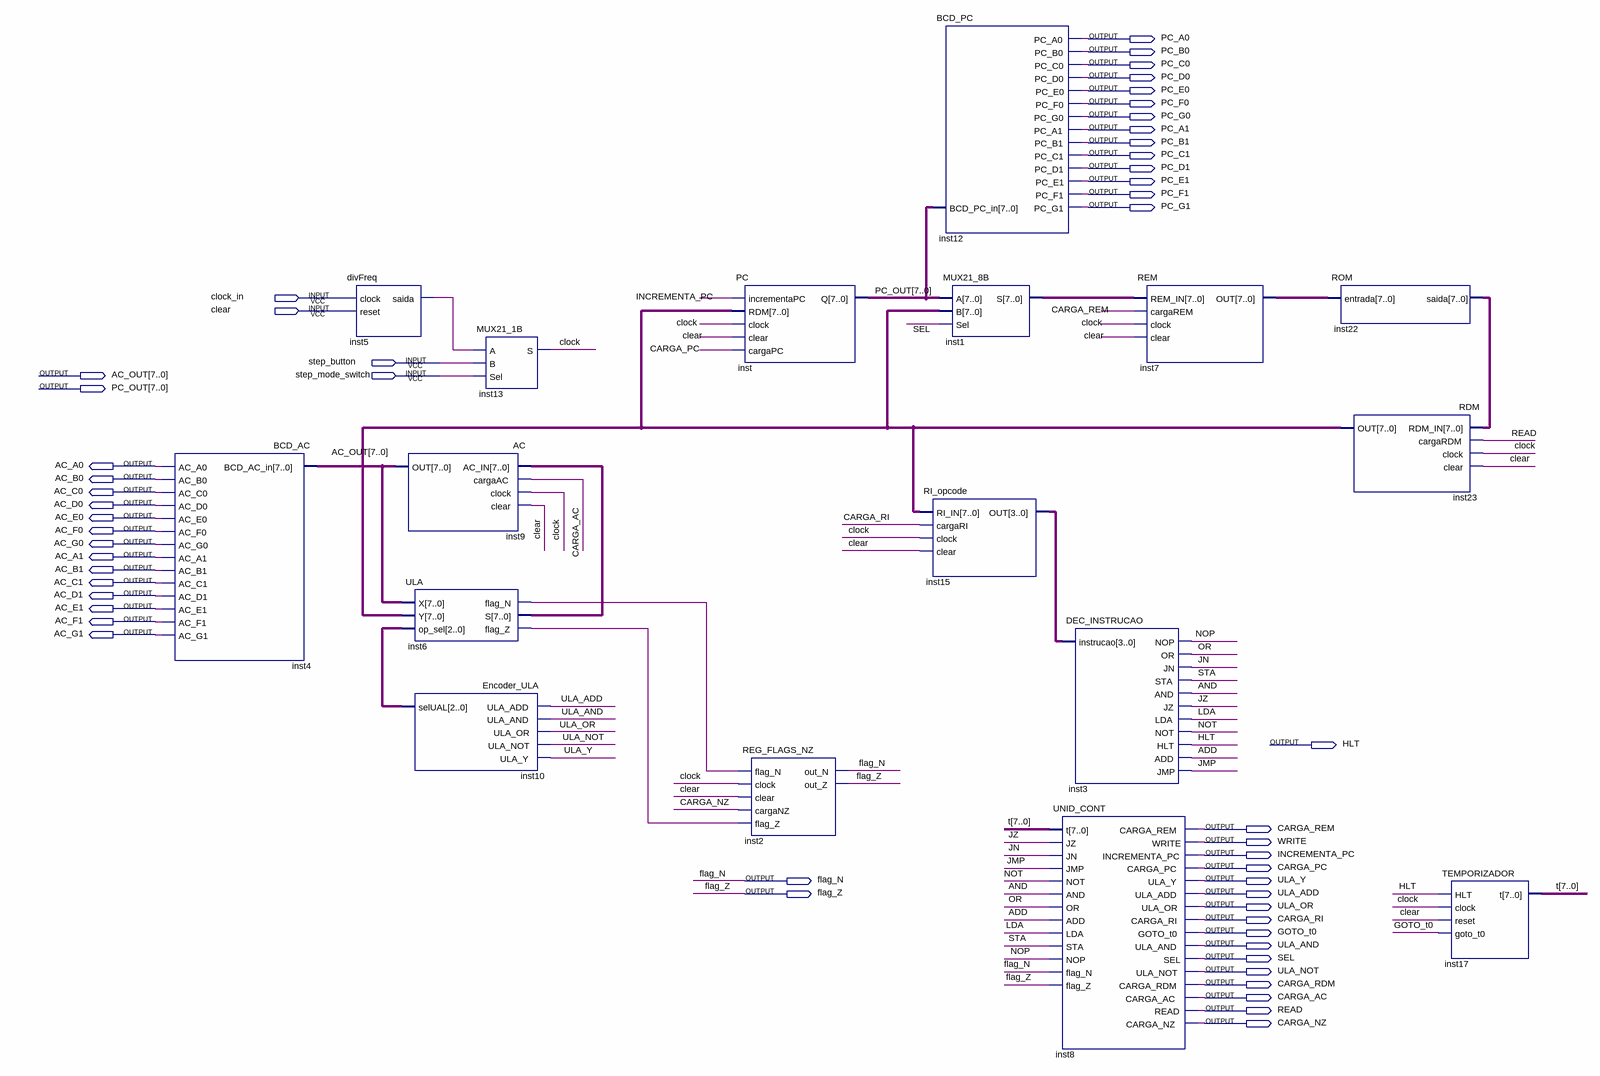
[diagram p0: schematic sheet]
// Quartus schematic Neander.bdf as structural Verilog: 17 symbols, 53 pins
module Neander (
  input  clock_in,
  input  clear,
  input  step_button,
  input  step_mode_switch,
  output PC_A0,
  output PC_B0,
  output PC_C0,
  output PC_D0,
  output PC_E0,
  output PC_F0,
  output PC_G0,
  output PC_A1,
  output PC_B1,
  output PC_C1,
  output PC_D1,
  output PC_E1,
  output PC_F1,
  output PC_G1,
  output [7:0] AC_OUT,
  output [7:0] PC_OUT,
  output AC_A0,
  output AC_B0,
  output AC_C0,
  output AC_D0,
  output AC_E0,
  output AC_F0,
  output AC_G0,
  output AC_A1,
  output AC_B1,
  output AC_C1,
  output AC_D1,
  output AC_E1,
  output AC_F1,
  output AC_G1,
  output HLT,
  output CARGA_REM,
  output WRITE,
  output INCREMENTA_PC,
  output CARGA_PC,
  output flag_N,
  output ULA_Y,
  output flag_Z,
  output ULA_ADD,
  output ULA_OR,
  output CARGA_RI,
  output GOTO_t0,
  output ULA_AND,
  output SEL,
  output ULA_NOT,
  output CARGA_RDM,
  output CARGA_AC,
  output READ,
  output CARGA_NZ
);

  wire ADD, AND, clock, inst5_saida, inst6_flag_n, inst6_flag_z, JMP, JN, JZ, LDA, NOP, NOT, OR, STA;
  wire [2:0] inst10_selual;
  wire [3:0] inst15_out;
  wire [7:0] inst1_s, inst6_s, inst7_out, inst22_saida, inst23_out, t;

  BCD_AC inst4 (
    .BCD_AC_in(AC_OUT), .AC_A0(AC_A0), .AC_B0(AC_B0), .AC_C0(AC_C0), .AC_D0(AC_D0), .AC_E0(AC_E0),
    .AC_F0(AC_F0), .AC_G0(AC_G0), .AC_A1(AC_A1), .AC_B1(AC_B1), .AC_C1(AC_C1), .AC_D1(AC_D1), .AC_E1(AC_E1),
    .AC_F1(AC_F1), .AC_G1(AC_G1));
  divFreq inst5 (.clock(clock_in), .reset(clear), .saida(inst5_saida));
  AC inst9 (.AC_IN(inst6_s), .cargaAC(CARGA_AC), .clock(clock), .clear(clear), .OUT(AC_OUT));
  ULA inst6 (
    .X(AC_OUT), .Y(inst23_out), .op_sel(inst10_selual), .flag_N(inst6_flag_n), .S(inst6_s),
    .flag_Z(inst6_flag_z));
  Encoder_ULA inst10 (
    .ULA_ADD(ULA_ADD), .ULA_AND(ULA_AND), .ULA_OR(ULA_OR), .ULA_NOT(ULA_NOT), .ULA_Y(ULA_Y),
    .selUAL(inst10_selual));
  MUX21_1B inst13 (.A(inst5_saida), .B(step_button), .Sel(step_mode_switch), .S(clock));
  PC inst (
    .incrementaPC(INCREMENTA_PC), .RDM(inst23_out), .clock(clock), .clear(clear), .cargaPC(CARGA_PC),
    .Q(PC_OUT));
  REG_FLAGS_NZ inst2 (
    .flag_N(inst6_flag_n), .clock(clock), .clear(clear), .cargaNZ(CARGA_NZ), .flag_Z(inst6_flag_z),
    .out_N(flag_N), .out_Z(flag_Z));
  BCD_PC inst12 (
    .BCD_PC_in(PC_OUT), .PC_A0(PC_A0), .PC_B0(PC_B0), .PC_C0(PC_C0), .PC_D0(PC_D0), .PC_E0(PC_E0),
    .PC_F0(PC_F0), .PC_G0(PC_G0), .PC_A1(PC_A1), .PC_B1(PC_B1), .PC_C1(PC_C1), .PC_D1(PC_D1), .PC_E1(PC_E1),
    .PC_F1(PC_F1), .PC_G1(PC_G1));
  MUX21_8B inst1 (.A(PC_OUT), .B(inst23_out), .Sel(SEL), .S(inst1_s));
  RI_opcode inst15 (.RI_IN(inst23_out), .cargaRI(CARGA_RI), .clock(clock), .clear(clear), .OUT(inst15_out));
  DEC_INSTRUCAO inst3 (
    .instrucao(inst15_out), .NOP(NOP), .OR(OR), .JN(JN), .STA(STA), .AND(AND), .JZ(JZ), .LDA(LDA), .NOT(NOT),
    .HLT(HLT), .ADD(ADD), .JMP(JMP));
  UNID_CONT inst8 (
    .t(t), .JZ(JZ), .JN(JN), .JMP(JMP), .NOT(NOT), .AND(AND), .OR(OR), .ADD(ADD), .LDA(LDA), .STA(STA),
    .NOP(NOP), .flag_N(flag_N), .flag_Z(flag_Z), .CARGA_REM(CARGA_REM), .WRITE(WRITE),
    .INCREMENTA_PC(INCREMENTA_PC), .CARGA_PC(CARGA_PC), .ULA_Y(ULA_Y), .ULA_ADD(ULA_ADD), .ULA_OR(ULA_OR),
    .CARGA_RI(CARGA_RI), .GOTO_t0(GOTO_t0), .ULA_AND(ULA_AND), .SEL(SEL), .ULA_NOT(ULA_NOT),
    .CARGA_RDM(CARGA_RDM), .CARGA_AC(CARGA_AC), .READ(READ), .CARGA_NZ(CARGA_NZ));
  REM inst7 (.REM_IN(inst1_s), .cargaREM(CARGA_REM), .clock(clock), .clear(clear), .OUT(inst7_out));
  ROM inst22 (.entrada(inst7_out), .saida(inst22_saida));
  RDM inst23 (.RDM_IN(inst22_saida), .cargaRDM(READ), .clock(clock), .clear(clear), .OUT(inst23_out));
  TEMPORIZADOR inst17 (.HLT(HLT), .clock(clock), .reset(clear), .goto_t0(GOTO_t0), .t(t));
endmodule
